# EAGLE design powermgr (EAGLE 6.4)
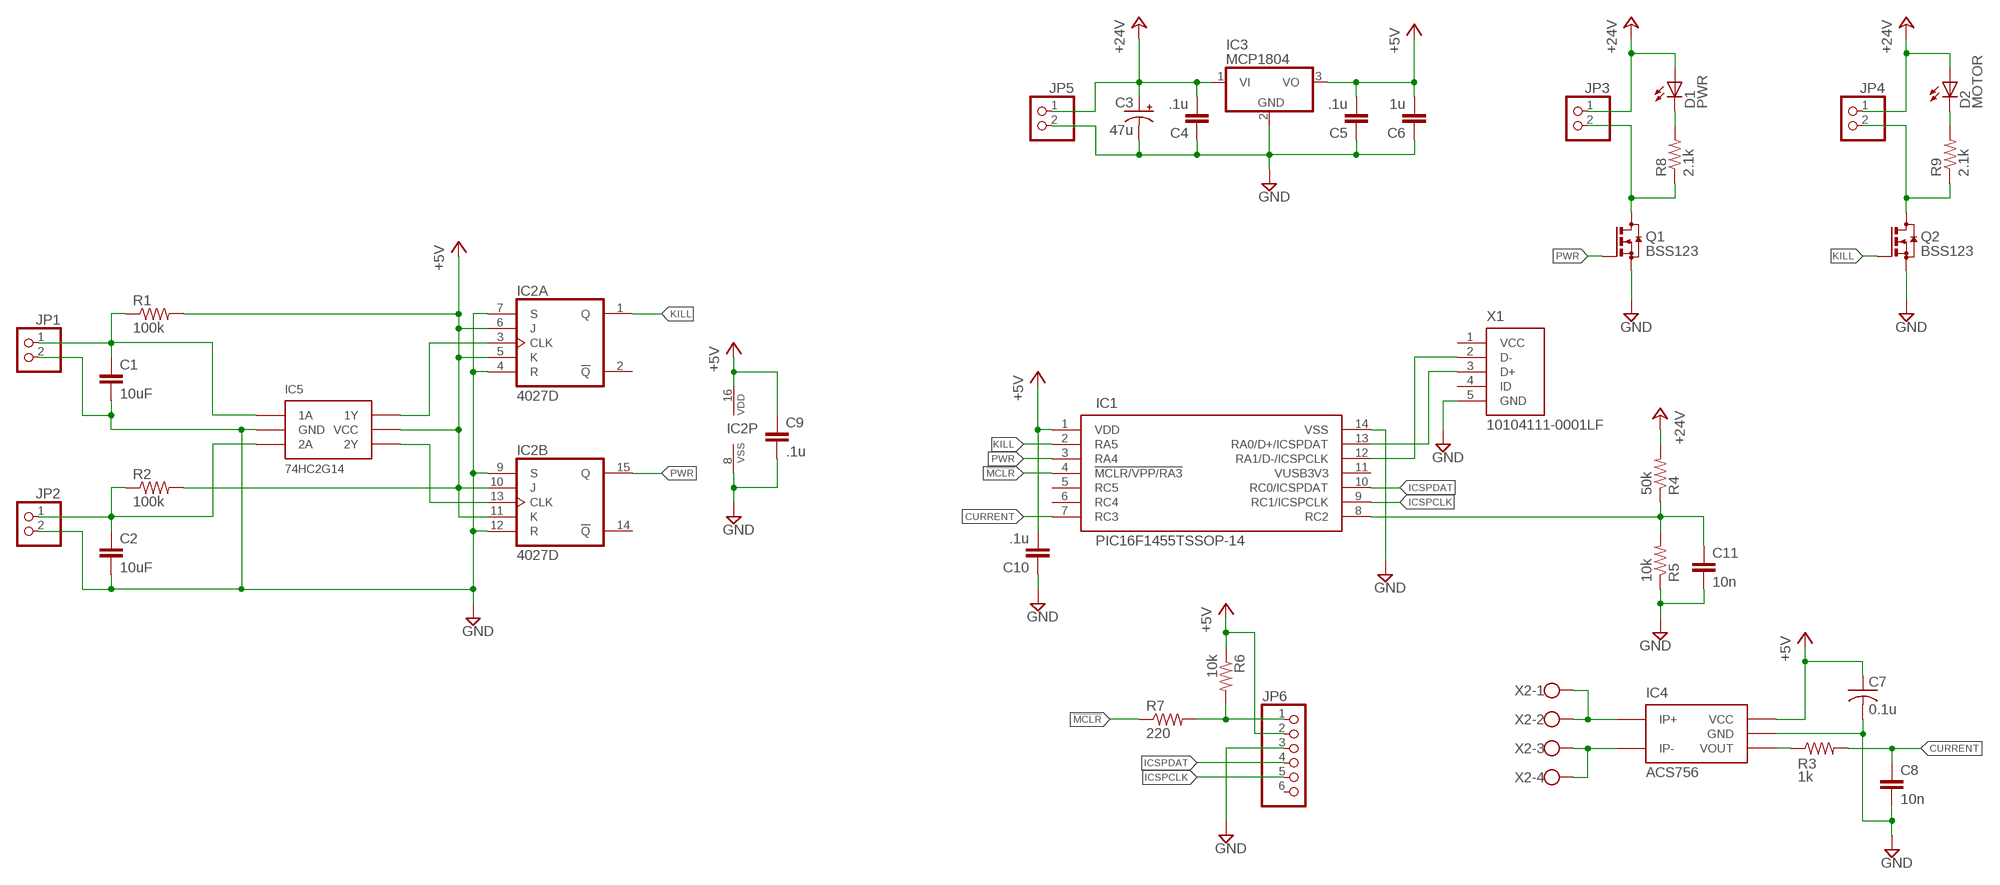
[diagram p0: schematic, sheet 1]

## Parts
C1  10uF  C-EUC0805  [C0805]
C2  10uF  C-EUC0805  [C0805]
C3  47u  CPOL-USE2.5-6  [E2,5-6]
C4  .1u  C-EUC0805  [C0805]
C5  .1u  C-EUC0805  [C0805]
C6  1u  C-EUC0805  [C0805]
C7  0.1u  C-USC1206K  [C1206K]
C8  10n  C-EUC0603K  [C0603K]
C9  .1u  C-EUC0603K  [C0603K]
C10  .1u  C-EUC0603K  [C0603K]
C11  10n  C-EUC0603K  [C0603K]
D1  PWR  LEDCHIP-LED0805  [CHIP-LED0805]
D2  MOTOR  LEDCHIP-LED0805  [CHIP-LED0805]
IC1  PIC16F1455TSSOP-14  [TSSOP-14]
IC2  4027D  [SO16]
IC3  MCP1804  MCP1703DB  [SOT223]
IC4  ACS756  [5PFF]
IC5  74HC2G14  [TSSOP-6]
JP1  PINHD-1X2  [1X02]
JP2  PINHD-1X2  [1X02]
JP3  PINHD-1X2  [1X02]
JP4  PINHD-1X2  [1X02]
JP5  PINHD-1X2  [1X02]
JP6  PINHD-1X6  [1X06]
Q1  BSS123  [SOT23]
Q2  BSS123  [SOT23]
R1  100k  R-US_R0805  [R0805]
R2  100k  R-US_R0805  [R0805]
R3  1k  R-US_R0603  [R0603]
R4  50k  R-US_R0603  [R0603]
R5  10k  R-US_R0603  [R0603]
R6  10k  R-US_R0603  [R0603]
R7  220  R-US_R0603  [R0603]
R8  2.1k  R-US_R0805  [R0805]
R9  2.1k  R-US_R0805  [R0805]
X1  10104111-0001LF  [USBAB]
X2  W237-4  [W237-4]

## Nets
!MCLR: IC1.4(!MCLR/VPP/RA3) R7.1
+5V: C5.2 C6.2 C7.1 C9.1 C10.2 IC1.1(VDD) IC2.5(A:K) IC2.6(A:J) IC2.10(B:J) IC2.11(B:K) IC2.16(P:VDD) IC3.3(VO) IC4.1(VCC) IC5.5(VCC) JP6.2 R1.2 R2.2 R6.1
+24V: C3.+ C4.2 D1.A D2.A IC3.1(VI) JP3.1 JP4.1 JP5.1 R4.2
CURRENT: C8.1 IC1.7(RC3) R3.2
GND: C1.2 C2.2 C3.- C4.1 C5.1 C6.1 C7.2 C8.2 C9.2 C10.1 C11.2 IC1.14(VSS) IC2.4(A:R) IC2.7(A:S) IC2.8(P:VSS) IC2.9(B:S) IC2.12(B:R) IC3.2(GND) IC4.2(GND) IC5.2(GND) JP1.2 JP2.2 JP5.2 JP6.3 Q1.2(S) Q2.2(S) R5.1 X1.5(GND)
ICSPCLK: IC1.9(RC1/ICSPCLK) JP6.5
ICSPDAT: IC1.10(RC0/ICSPDAT) JP6.4
KILL: IC1.2(RA5) IC2.1(A:Q) Q2.1(G)
N$1: C1.1 IC5.1(1A) JP1.1 R1.1
N$3: JP3.2 Q1.3(D) R8.1
N$4: JP4.2 Q2.3(D) R9.1
N$5: IC4.4(IP+) X2.1 X2.2
N$6: IC4.5(IP-) X2.3 X2.4
N$7: D1.C R8.2
N$9: IC4.3(VOUT) R3.1
N$10: C11.1 IC1.8(RC2) R4.1 R5.2
N$11: JP6.1 R6.2 R7.2
N$12: D2.C R9.2
N$15: C2.1 IC5.3(2A) JP2.1 R2.1
N$17: IC2.3(A:CLK) IC5.6(1Y)
N$18: IC2.13(B:CLK) IC5.4(2Y)
PWR: IC1.3(RA4) IC2.15(B:Q) Q1.1(G)
USBD+: IC1.13(RA0/D+/ICSPDAT) X1.3(D+)
USBD-: IC1.12(RA1/D-/ICSPCLK) X1.2(D-)
Unconnected: IC1.5(RC5) IC1.6(RC4) IC1.11(VUSB3V3) IC2.2(A:!Q) IC2.14(B:!Q) JP6.6 X1.1(VCC) X1.4(ID)

## Library data of the parts
C1 C2 C4-C6 C8-C11 = resistor:C-EU: CAPACITOR, European symbol
C3 = resistor:CPOL-US: POLARIZED CAPACITOR, American symbol
C7 = resistor:C-US: CAPACITOR, American symbol
D1 D2 = led:LED: LED OSRAM: - CHIPLED LG R971, LG N971, LY N971, LG Q971, LY Q971, LO R971, LY R971 LH N974, LH R974 LS Q976, LO Q976, LY Q976 LO Q996 - Hyper CHIPLED LW Q18S LB Q993, LB Q99A, LB R99A - SideLED LS A670, LO A670, LY A670, LG A670, LP A670 LB A673, LV A673, LT A673, LW A673 LH A674 LY A675 LS A676, LA A676, LO A676, LY A676, LW A676 LS A679, LY A679, LG A679 - Hyper Micro SIDELED® LS Y876, LA Y876, LO Y876, LY Y876 LT Y87S - SmartLED LW L88C, LW L88S LB L89C, LB L89S, LG L890 LS L89K, LO L89K, LY L89K LS L896, LA L896, LO L896, LY L896 - TOPLED LS T670, LO T670, LY T670, LG T670, LP T670 LSG T670, LSP T670, LSY T670, LOP T670, LYG T670 LG T671, LOG T671, LSG T671 LB T673, LV T673, LT T673, LW T673 LH T674 LS T676, LA T676, LO T676, LY T676, LB T676, LH T676, LSB T676, LW T676 LB T67C, LV T67C, LT T67C, LS T67K, LO T67K, LY T67K, LW E67C LS E67B, LA E67B, LO E67B, LY E67B, LB E67C, LV E67C, LT E67C LW T67C LS T679, LY T679, LG T679 LS T770, LO T770, LY T770, LG T770, LP T770 LB T773, LV T773, LT T773, LW T773 LH T774 LS E675, LA E675, LY E675, LS T675 LS T776, LA T776, LO T776, LY T776, LB T776 LHGB T686 LT T68C, LB T68C - Hyper Mini TOPLED® LB M676 - Mini TOPLED Santana® LG M470 LS M47K, LO M47K, LY M47K Source: http://www.osram.convergy.de LUXEON: - LUMILED® LXK2-PW12-R00, LXK2-PW12-S00, LXK2-PW14-U00, LXK2-PW14-V00 LXK2-PM12-R00, LXK2-PM12-S00, LXK2-PM14-U00 LXK2-PE12-Q00, LXK2-PE12-R00, LXK2-PE12-S00, LXK2-PE14-T00, LXK2-PE14-U00 LXK2-PB12-K00, LXK2-PB12-L00, LXK2-PB12-M00, LXK2-PB14-N00, LXK2-PB14-P00, LXK2-PB14-Q00 LXK2-PR12-L00, LXK2-PR12-M00, LXK2-PR14-Q00, LXK2-PR14-R00 LXK2-PD12-Q00, LXK2-PD12-R00, LXK2-PD12-S00 LXK2-PH12-R00, LXK2-PH12-S00 LXK2-PL12-P00, LXK2-PL12-Q00, LXK2-PL12-R00 Source: www.luxeon.com KINGBRIGHT: KA-3528ASYC Source: www.kingbright.com
IC1 = custom:PIC16F1455
IC2 = 40xx:4027: Dual JK FLIP FLOP
IC3 = linear:MCP1703: 250 mA, 16V, Low Quiescent Current LDO Regulator Source: http://ww1.microchip.com/downloads/en/DeviceDoc/22049b.pdf
IC4 = custom:ACS756
IC5 = custom:74HC2G14
JP1-JP5 = pinhead:PINHD-1X2: PIN HEADER
JP6 = pinhead:PINHD-1X6: PIN HEADER
Q1 Q2 = transistor-small-signal:BSS123: N-CHANNEL MOS FET
R1-R9 = resistor:R-US_: RESISTOR, American symbol
X1 = custom:10104111-0001LF
X2 = con-wago-500:W237-4: WAGO SCREW CLAMP; OC_FARNELL: unknown; OC_NEWARK: unknown

## Board
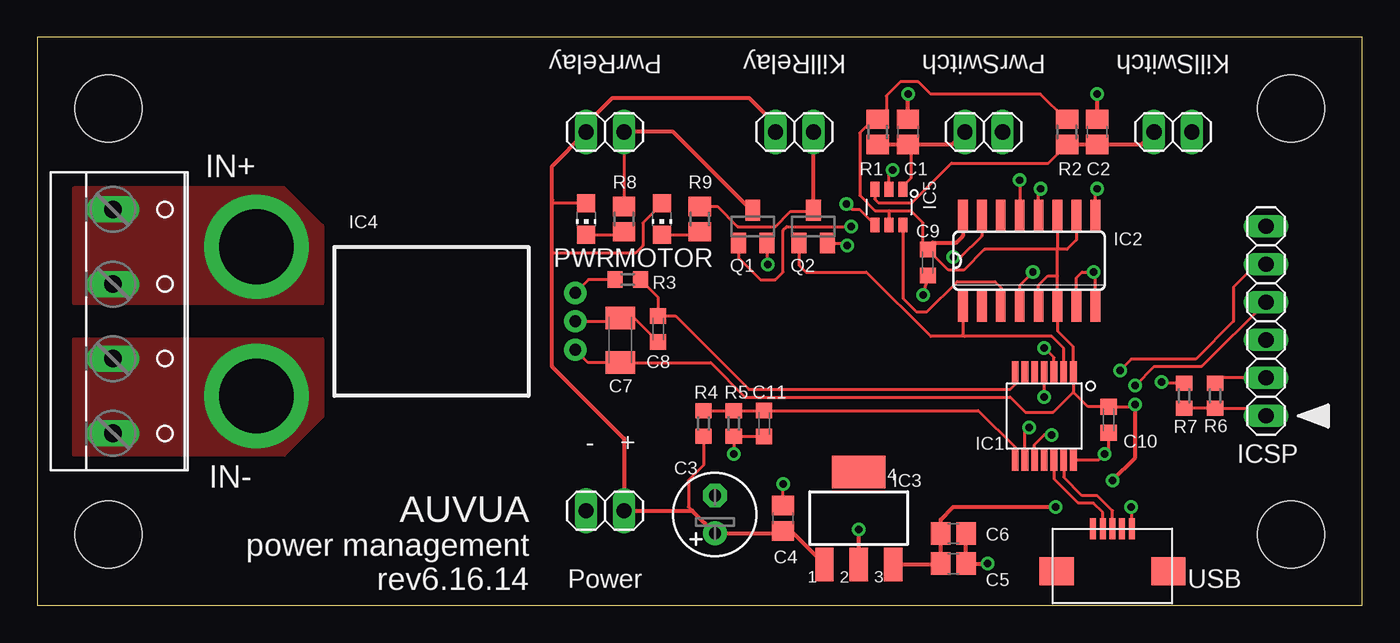
[diagram p1: board, top side]
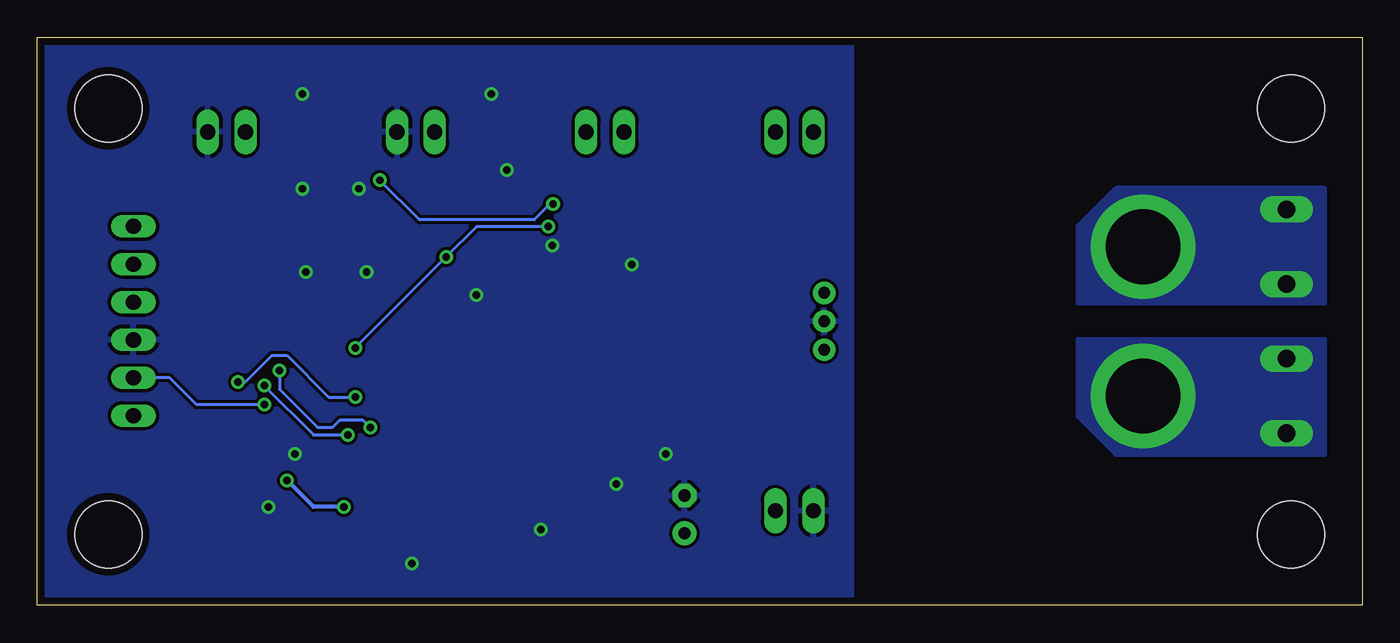
[diagram p2: board, bottom side, seen from below]

Size 88.9 x 38.1 mm. Coordinates in mm from the lower left corner, seen from the top.
Outline: 0,0 88.9,0 88.9,38.1 0,38.1 0,0
Copper layers (1*16): Top 0.035mm / dielectric 1.5mm / Bottom 0.035mm
Design rules "default *": minimum track width 8mil, minimum drill 19mil, track to track 8mil, track to pad 8mil, pad to pad 8mil, via to via 8mil, smd to smd 8mil, copper to edge 20mil, drill to drill 8mil, minimum pad ring 10mil, minimum via ring 8mil, stop-mask expansion 0mil, vias tented up to drill 0mil, thermal gap 10mil
Holes 4.5 mm at 4.76,33.34 4.76,4.76 84.14,4.76 84.14,33.34

### Footprints (pad centres in the part's own frame; a part is rotated, then mirrored left to right if it is on the bottom)
C0805 = smd 1.3 x 1.5: 1 -0.85,0; 2 0.85,0
E2,5-6 = drill 0.813 pad 1.6: + -1.27,0 | drill 0.813 pad 1.6 octagon: - 1.27,0
C1206K = smd 1.5 x 2: 1 -1.5,0; 2 1.5,0
C0603K = smd 1.05 x 1.08: 1 -0.875,0; 2 0.875,0
CHIP-LED0805 = smd 1.2 x 1.2: A 0,-1.05; C 0,1.05
TSSOP-14 = smd 1.45 x 0.45: 1 -2.95,1.95; 2 -2.95,1.3; 3 -2.95,0.65; 4 -2.95,0; 5 -2.95,-0.65; 6 -2.95,-1.3; 7 -2.95,-1.95; 8 2.95,-1.95; 9 2.95,-1.3; 10 2.95,-0.65; 11 2.95,0; 12 2.95,0.65; 13 2.95,1.3; 14 2.95,1.95
SO16 = smd 0.66 x 2.032: 1 -4.445,-3.073; 2 -3.175,-3.073; 3 -1.905,-3.073; 4 -0.635,-3.073; 5 0.635,-3.073; 6 1.905,-3.073; 7 3.175,-3.073; 8 4.445,-3.073; 9 4.445,3.073; 10 3.175,3.073; 11 1.905,3.073; 12 0.635,3.073; 13 -0.635,3.073; 14 -1.905,3.073; 15 -3.175,3.073; 16 -4.445,3.073
SOT223 = smd 1.219 x 2.235: 1 -2.311,-3.099; 2 0,-3.099; 3 2.311,-3.099 | smd 3.6 x 2.2: 4 0,3.099
5PFF = drill 0.8 pad 1.5: 1 -1.91,-10.7; 2 0,-10.7; 3 1.91,-10.7 | drill 5 pad 7: 4 5,10.7; 5 -5,10.7
TSSOP-6 = smd 1 x 0.6: 1 -1.2,0.95; 2 -1.2,0; 3 -1.2,-0.95; 4 1.2,-0.95; 5 1.2,0; 6 1.2,0.95
1X02 = drill 1.016 long: 1 -1.27,0; 2 1.27,0
1X06 = drill 1.016 long: 1 -6.35,0; 2 -3.81,0; 3 -1.27,0; 4 1.27,0; 5 3.81,0; 6 6.35,0
SOT23 = smd 1 x 1.4: 1 -0.95,-1.1; 2 0.95,-1.1; 3 0,1.1
R0805 = smd 1.3 x 1.5: 1 -0.85,0; 2 0.85,0
R0603 = smd 1 x 1.1: 1 -0.85,0; 2 0.85,0
USBAB = smd 0.4 x 1.4: 1 -1.3,2.85; 2 -0.65,2.85; 3 0,2.85; 4 0.65,2.85; 5 1.3,2.85 | smd 2.3 x 1.9: TAB1 -3.75,0; TAB2 3.75,0
W237-4 = drill 1.194 long: 1 -7.5,-1.27; 2 -2.5,-1.27; 3 2.5,-1.27; 4 7.5,-1.27

### Placement (x,y rotation side)
C1  58.42,31.75 90 top
C2  71.12,31.75 90 top
C3  45.47,6.1 90 top
C4  50.04,5.84 270 top
C5  61.47,2.79 180 top
C6  61.47,4.83 180 top
C7  39.12,17.78 90 top
C8  41.66,18.54 270 top
C9  59.75,22.99 270 top
C10  71.88,12.45 90 top
C11  48.77,12.19 270 top
D1  36.83,25.91 180 top
D2  41.91,25.91 180 top
IC1  67.56,12.7 270 top
IC2  66.55,23.11 0 top
IC3  55.12,5.84 0 top
IC4  25.4,19.05 90 top
IC5  57.15,26.71 270 top
JP1  63.5,31.75 0 top
JP2  76.2,31.75 0 top
JP3  38.1,31.75 0 top
JP4  50.8,31.75 0 top
JP5  38.1,6.35 180 top
JP6  82.45,19.07 90 top
Q1  48.01,25.4 0 top
Q2  52.07,25.4 0 top
R1  56.39,31.75 90 top
R2  69.09,31.75 90 top
R3  39.62,21.84 0 top
R4  44.7,12.19 270 top
R5  46.74,12.19 90 top
R6  79.03,14.06 270 top
R7  76.95,14.06 270 top
R8  39.37,25.91 270 top
R9  44.45,25.91 270 top
X1  72.14,2.29 0 top
X2  6.35,19.05 270 top

### Tracks (layer width: path | path; a pad name or v marks a point on that pad's centre or on a via)
!MCLR  (via drill 0.5)
  Top 0.203: R7.1 75.52,14.91 v75.44,14.99 | v67.56,13.97 IC1.4
  Bottom 0.203: v75.44,14.99 74.93,14.99 73.15,16.76 72.14,16.76 69.34,13.97 v67.56,13.97
+5V  (via drill 0.5)
  Top 0.203: JP6.2 79.03,15.26 R6.1 | 69.51,14.31 70.5,13.32 C10.2 73.55,13.32 v73.66,13.46 | 69.51,14.31 IC1.1 69.51,17.35 68.45,18.41 IC2.6 68.45,22.1 | IC4.1 36.96,16.28 C7.1 45.19,16.28 47.5,13.97 65.28,13.97 66.29,12.95 68.16,12.95 69.51,14.31 | 68.45,22.1 68.45,23.88 | IC2.5 67.18,21.46 67.82,22.1 68.45,22.1 | IC2.10 69.72,24.51 69.09,23.88 68.45,23.88 | IC2.11 68.45,23.88 | 68.45,23.88 63.56,23.88 62.17,22.48 61.14,22.48 C9.1 | 59.44,24.13 59.44,25.65 58.61,26.48 57.15,26.48 | 57.15,26.48 IC5.5 | 57.15,26.48 56.2,26.48 55.18,27.5 55.18,31.69 56.09,32.6 R1.2 56.96,33.17 56.96,34.16 57.91,35.12 59.12,35.12 59.94,34.29 67.31,34.29 69,32.6 R2.2
  Top 0.254: C9.1 59.44,24.13 60.07,24.32 61.66,24.32 62.1,24.77 IC2.16 | IC3.3 60.57,2.74 C5.2 C6.2 60.62,5.75 61.47,6.6 v68.33,6.6 | v72.14,8.38 73.66,9.91 v73.66,13.46
  Bottom 0.203: v73.66,13.46 78.21,13.46 80.01,15.26 JP6.2
  Bottom 0.254: v68.33,6.6 70.36,6.6 v72.14,8.38
+24V
  Top 0.203: R4.2 44.7,9.4 43.69,8.38 43.69,6.6 C3.+ | D1.A 34.54,26.96 34.54,27.18 | D2.A 41.91,26.92 40.64,25.65 40.64,24.13 40.13,23.62 34.54,23.62
  Top 0.254: JP4.1 49.53,32.26 47.75,34.04 38.61,34.04 36.83,32.26 JP3.1 34.54,29.46 34.54,27.18 34.54,23.62 34.54,16 39.37,11.18 JP5.1 43.94,6.35 C3.+ 49.87,4.83 C4.2 50.56,4.99 IC3.1
CURRENT
  Top 0.203: IC1.7 65.61,14.81 65.28,14.48 47.75,14.48 42.81,19.42 C8.1 41.66,20.66 R3.2
GND  (via drill 0.5)
  Top 0.203: C10.1 71.88,10.41 v71.63,10.16 71.22,9.75 IC1.14 | X1.5 73.44,6.57 v73.41,6.6 | Q2.2 54.19,24.3 v54.36,24.13 | Q1.2 48.96,22.93 v49.02,22.86 | C9.2 v59.44,20.83 | v46.74,10.16 R5.1 48.74,11.34 C11.2 | IC4.2 38.89,19.05 C7.2 40.04,19.28 C8.2 | IC2.12 67.18,27.81 v67.31,27.94 | IC2.9 70.99,27.81 v71.12,27.94 | IC2.4 65.91,21.46 v66.8,22.35 | IC2.8 70.99,22.23 v70.87,22.35 70.1,22.35 69.72,21.97 IC2.7 | C4.1 v50.04,8.13 | IC5.2 57.15,28.23 57.15,28.96 v57.4,29.21
  Top 0.254: IC3.2 v55.12,5.08 | C6.1 C5.1 v63.75,2.79 | C2.2 v71.12,34.29 | C1.2 v58.42,34.29
  pour Bottom: 34.29,39.37 34.29,-1.27 90.17,-1.27 90.17,39.37
ICSPCLK  (via drill 0.5)
  Top 0.203: JP6.5 81.81,22.88 80.26,21.34 80.26,19.05 77.72,16.51 73.41,16.51 v72.64,15.75 | IC1.9 66.26,11.65 v66.55,11.94
  Bottom 0.203: v72.64,15.75 72.64,14.48 70.1,11.94 69.09,11.94 68.58,12.45 67.06,12.45 v66.55,11.94
ICSPDAT  (via drill 0.5)
  Top 0.203: JP6.4 78.11,16 74.93,16 v73.66,14.73 | v68.07,11.43 67.56,11.43 66.91,10.78 IC1.10
  Bottom 0.203: v73.66,14.73 70.36,11.43 v68.07,11.43
KILL
  Top 0.203: IC1.2 68.86,17.24 68.07,18.03 62.23,18.03 | 62.23,18.03 59.94,18.03 55.63,22.35 51.56,22.35 51.12,22.79 Q2.1 | IC2.1 62.1,18.16 62.23,18.03
N$1
  Top 0.203: C1.1 58.61,30.9 58.61,28.64 58.1,28.12 IC5.1
  Top 0.254: JP1.1 61.38,30.9 C1.1 R1.1
N$3
  Top 0.203: JP3.2 R8.1
  Top 0.254: 47.92,26.5 42.67,31.75 JP3.2
  Top 0.406: Q1.3 47.92,26.5
N$4
  Top 0.203: R9.1 45.63,26.76 46.99,25.4 49.53,25.4 50.55,26.42 51.99,26.42 Q2.3
  Top 0.254: Q2.3 JP4.2
N$5
  pour Top (no thermals): 2.54,20.32 2.54,27.94 15.24,27.94 16.51,27.94 19.05,25.4 19.05,20.32
  pour Bottom (no thermals): 2.54,20.32 2.54,27.94 16.51,27.94 19.05,25.4 19.05,20.32
N$6
  pour Top (no thermals): 2.54,17.78 19.05,17.78 19.05,12.7 16.51,10.16 2.54,10.16
  pour Bottom (no thermals): 2.54,17.78 19.05,17.78 19.05,12.7 16.51,10.16 2.54,10.16
N$7
  Top 0.203: D1.C 39.37,24.86 R8.2
N$9
  Top 0.203: R3.1 36.98,21.84 IC4.3
N$10
  Top 0.203: R4.1 R5.2 48.74,13.04 C11.1 63.13,13.07 65.61,10.59 IC1.8
N$11
  Top 0.203: R7.2 R6.2 81.96,13.21 JP6.1
N$12
  Top 0.203: D2.C 44.25,24.86 R9.2
N$15
  Top 0.203: 69,30.9 R2.1 67.84,29.65 61.34,29.65 58.67,26.99 56.45,26.99 56.2,27.24 IC5.3
  Top 0.254: JP2.1 74.08,30.9 C2.1 R2.1
N$17
  Top 0.203: IC5.6 58.1,20.58 58.99,19.68 59.69,19.68 61.72,21.72 64.26,21.72 64.64,21.34 IC2.3
N$18  (via drill 0.5)
  Top 0.203: IC5.4 56.2,25.53 55.18,26.54 54.67,26.54 v54.29,26.92 | v65.91,28.51 IC2.13
  Bottom 0.203: v54.29,26.92 54.48,26.92 55.56,25.84 63.25,25.84 v65.91,28.51
PWR  (via drill 0.5)
  Top 0.203: 47.06,24.45 Q1.1 47.06,23.3 48.51,21.84 49.53,21.84 50.04,22.35 50.04,25.15 50.29,25.4 v54.61,25.4 | IC2.15 63.37,24.77 61.98,23.37 v61.47,23.37 | IC1.3 68.21,16.62 v67.56,17.27
  Bottom 0.203: v54.61,25.4 59.44,25.4 v61.47,23.37 v67.56,17.27
USBD+
  Top 0.203: X1.3 72.14,6.35 71.12,7.37 70.1,7.37 68.86,8.61 IC1.13
USBD-
  Top 0.203: X1.2 71.49,6.24 70.87,6.86 69.85,6.86 68.21,8.49 IC1.12

### Text on the board
tPlace: PwrRelay | KillRelay | PwrSwitch | KillSwitch | IN+ | PWR | MOTOR | - | + | ICSP | IN- | AUVUA | power management | rev6.16.14 | Power | USB